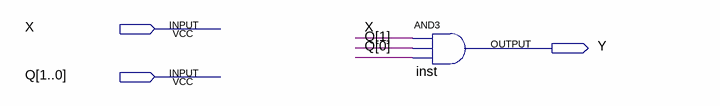
[diagram p0: schematic sheet]
// Quartus schematic OUTPUT_Y.bdf as structural Verilog: 1 symbols, 3 pins
module OUTPUT_Y (
  input  X,
  input  [1:0] Q,
  output Y
);

  and inst (Y, X, Q[1], Q[0]);
endmodule
